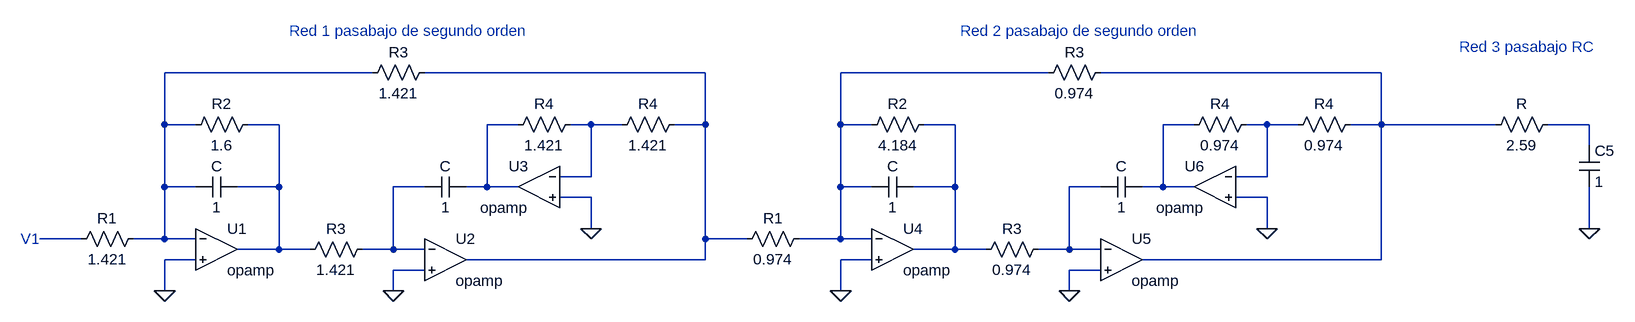
[diagram p0: schematic cascada.asc]
cascada.asc, the LTspice schematic file:
Version 4.1
SHEET 1 2252 680
WIRE 336 -96 16 -96
WIRE 848 -96 416 -96
WIRE 1376 -96 1056 -96
WIRE 1888 -96 1456 -96
WIRE 16 -16 16 -96
WIRE 64 -16 16 -16
WIRE 192 -16 144 -16
WIRE 560 -16 512 -16
WIRE 672 -16 640 -16
WIRE 720 -16 672 -16
WIRE 848 -16 848 -96
WIRE 848 -16 800 -16
WIRE 1056 -16 1056 -96
WIRE 1104 -16 1056 -16
WIRE 1232 -16 1184 -16
WIRE 1600 -16 1552 -16
WIRE 1712 -16 1680 -16
WIRE 1760 -16 1712 -16
WIRE 1888 -16 1888 -96
WIRE 1888 -16 1840 -16
WIRE 2064 -16 1888 -16
WIRE 2208 -16 2144 -16
WIRE 2208 16 2208 -16
WIRE 672 64 672 -16
WIRE 672 64 624 64
WIRE 1712 64 1712 -16
WIRE 1712 64 1664 64
WIRE 16 80 16 -16
WIRE 64 80 16 80
WIRE 192 80 192 -16
WIRE 192 80 128 80
WIRE 416 80 368 80
WIRE 512 80 512 -16
WIRE 512 80 480 80
WIRE 560 80 512 80
WIRE 1056 80 1056 -16
WIRE 1104 80 1056 80
WIRE 1232 80 1232 -16
WIRE 1232 80 1168 80
WIRE 1456 80 1408 80
WIRE 1552 80 1552 -16
WIRE 1552 80 1520 80
WIRE 1600 80 1552 80
WIRE 672 96 624 96
WIRE 1712 96 1664 96
WIRE 672 144 672 96
WIRE 1712 144 1712 96
WIRE 2208 144 2208 80
WIRE -112 160 -176 160
WIRE 16 160 16 80
WIRE 16 160 -32 160
WIRE 64 160 16 160
WIRE 848 160 848 -16
WIRE 912 160 848 160
WIRE 1056 160 1056 80
WIRE 1056 160 992 160
WIRE 1104 160 1056 160
WIRE 192 176 192 80
WIRE 192 176 128 176
WIRE 240 176 192 176
WIRE 368 176 368 80
WIRE 368 176 320 176
WIRE 416 176 368 176
WIRE 1232 176 1232 80
WIRE 1232 176 1168 176
WIRE 1280 176 1232 176
WIRE 1408 176 1408 80
WIRE 1408 176 1360 176
WIRE 1456 176 1408 176
WIRE 64 192 16 192
WIRE 848 192 848 160
WIRE 848 192 480 192
WIRE 1104 192 1056 192
WIRE 1888 192 1888 -16
WIRE 1888 192 1520 192
WIRE 416 208 368 208
WIRE 1456 208 1408 208
WIRE 16 240 16 192
WIRE 368 240 368 208
WIRE 1056 240 1056 192
WIRE 1408 240 1408 208
FLAG 16 240 0
FLAG 368 240 0
FLAG 672 144 0
FLAG 1056 240 0
FLAG 1408 240 0
FLAG 1712 144 0
FLAG 2208 144 0
SYMBOL res -16 144 R90
WINDOW 0 0 56 VBottom 2
WINDOW 3 32 56 VTop 2
SYMATTR InstName R1
SYMATTR Value 1.421
SYMBOL res 160 -32 R90
WINDOW 0 0 56 VBottom 2
WINDOW 3 32 56 VTop 2
SYMATTR InstName R2
SYMATTR Value 1.6
SYMBOL res 336 160 R90
WINDOW 0 0 56 VBottom 2
WINDOW 3 32 56 VTop 2
SYMATTR InstName R3
SYMATTR Value 1.421
SYMBOL res 432 -112 R90
WINDOW 0 0 56 VBottom 2
WINDOW 3 32 56 VTop 2
SYMATTR InstName R3
SYMATTR Value 1.421
SYMBOL res 656 -32 R90
WINDOW 0 0 56 VBottom 2
WINDOW 3 32 56 VTop 2
SYMATTR InstName R4
SYMATTR Value 1.421
SYMBOL res 816 -32 R90
WINDOW 0 0 56 VBottom 2
WINDOW 3 32 56 VTop 2
SYMATTR InstName R4
SYMATTR Value 1.421
SYMBOL OpAmps\\opamp 96 112 R0
SYMATTR InstName U1
SYMBOL cap 128 64 R90
WINDOW 0 0 32 VBottom 2
WINDOW 3 32 32 VTop 2
SYMATTR InstName C
SYMATTR Value 1
SYMBOL OpAmps\\opamp 448 128 R0
SYMATTR InstName U2
SYMBOL OpAmps\\opamp 592 16 M0
SYMATTR InstName U3
SYMBOL cap 480 64 R90
WINDOW 0 0 32 VBottom 2
WINDOW 3 32 32 VTop 2
SYMATTR InstName C
SYMATTR Value 1
SYMBOL res 1200 -32 R90
WINDOW 0 0 56 VBottom 2
WINDOW 3 32 56 VTop 2
SYMATTR InstName R2
SYMATTR Value 4.184
SYMBOL res 1376 160 R90
WINDOW 0 0 56 VBottom 2
WINDOW 3 32 56 VTop 2
SYMATTR InstName R3
SYMATTR Value 0.974
SYMBOL res 1472 -112 R90
WINDOW 0 0 56 VBottom 2
WINDOW 3 32 56 VTop 2
SYMATTR InstName R3
SYMATTR Value 0.974
SYMBOL res 1696 -32 R90
WINDOW 0 0 56 VBottom 2
WINDOW 3 32 56 VTop 2
SYMATTR InstName R4
SYMATTR Value 0.974
SYMBOL res 1856 -32 R90
WINDOW 0 0 56 VBottom 2
WINDOW 3 32 56 VTop 2
SYMATTR InstName R4
SYMATTR Value 0.974
SYMBOL OpAmps\\opamp 1136 112 R0
SYMATTR InstName U4
SYMBOL cap 1168 64 R90
WINDOW 0 0 32 VBottom 2
WINDOW 3 32 32 VTop 2
SYMATTR InstName C
SYMATTR Value 1
SYMBOL OpAmps\\opamp 1488 128 R0
SYMATTR InstName U5
SYMBOL OpAmps\\opamp 1632 16 M0
SYMATTR InstName U6
SYMBOL cap 1520 64 R90
WINDOW 0 0 32 VBottom 2
WINDOW 3 32 32 VTop 2
SYMATTR InstName C
SYMATTR Value 1
SYMBOL res 1008 144 R90
WINDOW 0 0 56 VBottom 2
WINDOW 3 32 56 VTop 2
SYMATTR InstName R1
SYMATTR Value 0.974
SYMBOL res 2160 -32 R90
WINDOW 0 0 56 VBottom 2
WINDOW 3 32 56 VTop 2
SYMATTR InstName R
SYMATTR Value 2.59
SYMBOL cap 2192 16 R0
SYMATTR InstName C5
SYMATTR Value 1
TEXT -176 160 Right 2 ;V1
TEXT 208 -160 Left 2 ;Red 1 pasabajo de segundo orden
TEXT 1240 -160 Left 2 ;Red 2 pasabajo de segundo orden
TEXT 2008 -136 Left 2 ;Red 3 pasabajo RC

The netlist it stands for:
* cascada.asc
R1 N001 N014 1.421
R2 N005 N001 1.6
R3 N012 N005 1.421
R3 N002 N001 1.421
R4 N007 N006 1.421
R4 N002 N007 1.421
X§U1 N001 0 N005 opamp Aol=100K GBW=10Meg  ; pins invin noninvin out
C N005 N001 1
X§U2 N012 0 N002 opamp Aol=100K GBW=10Meg  ; pins invin noninvin out
X§U3 N007 0 N006 opamp Aol=100K GBW=10Meg  ; pins invin noninvin out
C N006 N012 1
R2 N008 N003 4.184
R3 N013 N008 0.974
R3 N004 N003 0.974
R4 N010 N009 0.974
R4 N004 N010 0.974
X§U4 N003 0 N008 opamp Aol=100K GBW=10Meg  ; pins invin noninvin out
C N008 N003 1
X§U5 N013 0 N004 opamp Aol=100K GBW=10Meg  ; pins invin noninvin out
X§U6 N010 0 N009 opamp Aol=100K GBW=10Meg  ; pins invin noninvin out
C N009 N013 1
R1 N003 N002 0.974
R N011 N004 2.59
C5 N011 0 1
* V1
* Red 1 pasabajo de segundo orden
* Red 2 pasabajo de segundo orden
* Red 3 pasabajo RC
.backanno
.end